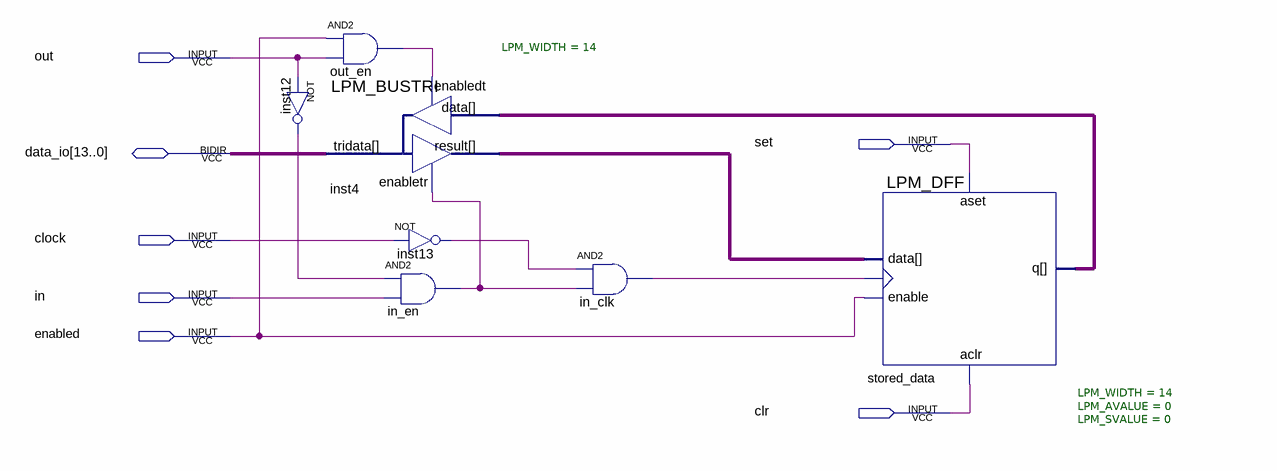
[diagram p0: schematic sheet]
// Quartus schematic register14.bdf as structural Verilog: 7 symbols, 7 pins
module register14 (
  input  out,
  input  set,
  input  clock,
  input  in,
  input  enabled,
  input  clr,
  inout  [13:0] data_io
);

  wire in_clk_out, in_en_out, inst12_out, inst13_out, out_en_out;
  wire [13:0] inst4_result, stored_data_q;

  not inst12 (inst12_out, out);
  and out_en (out_en_out, enabled, out);
  LPM_BUSTRI #(.LPM_WIDTH(14)) inst4 (
    .data(stored_data_q), .enabledt(out_en_out), .enabletr(in_en_out), .result(inst4_result),
    .tridata(data_io));
  not inst13 (inst13_out, clock);
  and in_en (in_en_out, inst12_out, in);
  and in_clk (in_clk_out, inst13_out, in_en_out);
  LPM_DFF #(.LPM_WIDTH(14), .LPM_AVALUE(0), .LPM_SVALUE(0)) stored_data (
    .enable(enabled), .clock(in_clk_out), .data(inst4_result), .aset(set), .aclr(clr), .q(stored_data_q));
endmodule
